# EAGLE schematic Motherboard (EAGLE 9.1.0)
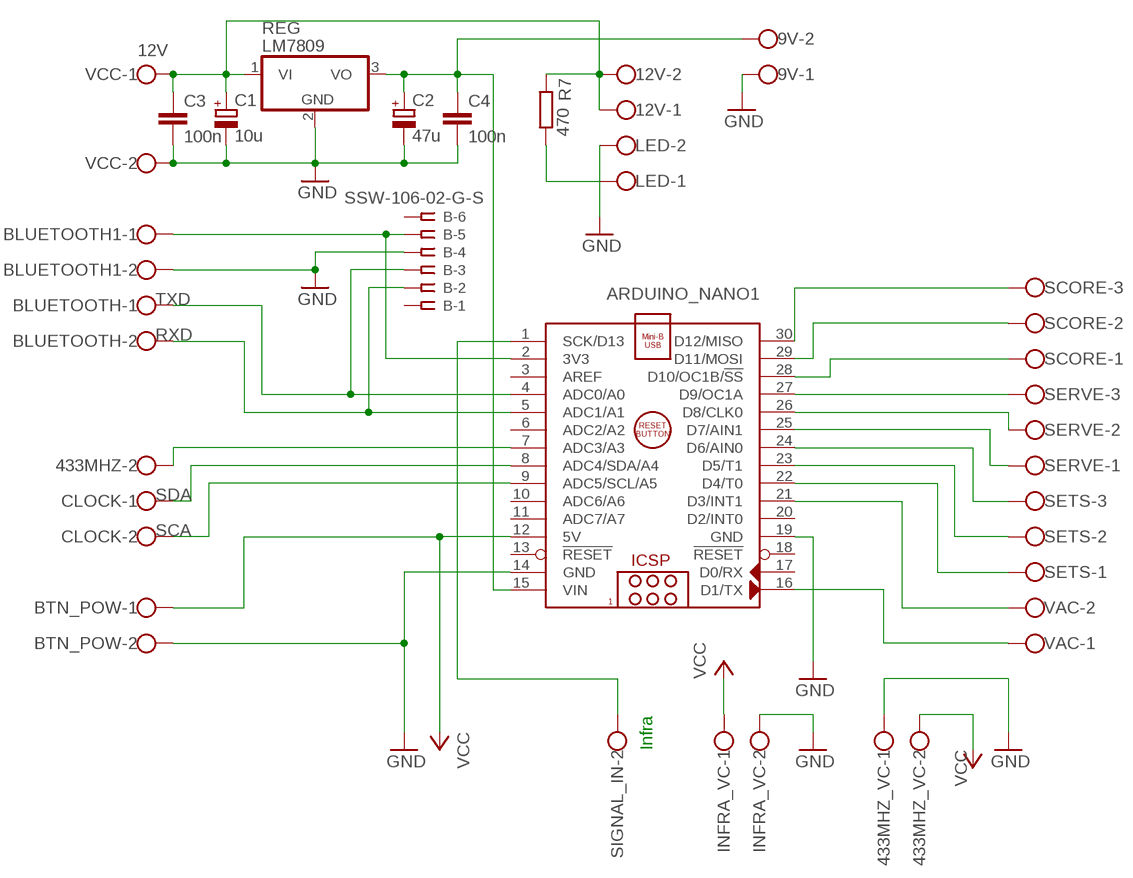
[diagram p0: schematic, sheet 1]

## Parts
9V  W237-102  [W237-102]
12V  W237-102  [W237-102]
433MHZ  W237-102  [W237-102]
433MHZ_VC  W237-102  [W237-102]
ARDUINO_NANO1  ARDUINO_NANO  [ARDUINO_NANO]
B  SSW-106-02-G-S  [SSW-106-02-G-S]
BLUETOOTH  W237-102  [W237-102]
BLUETOOTH1  W237-102  [W237-102]
BTN_POW  W237-102  [W237-102]
C1  10u  CPOL-EUE2-4  [E2-4]
C2  47u  CPOL-EUE2-4  [E2-4]
C3  100n  C5/2.5  [C5B2.5]
C4  100n  C5/2.5  [C5B2.5]
CLOCK  W237-102  [W237-102]
INFRA_VC  W237-102  [W237-102]
LED  W237-102  [W237-102]
R7  470  R-EU_0204/7  [0204/7]
REG  LM7809  7805T  [TO220H]
SCORE  W237-103  [W237-103]
SERVE  W237-103  [W237-103]
SETS  W237-103  [W237-103]
SIGNAL_IN  W237-102  [W237-102]
VAC  W237-102  [W237-102]
VCC  W237-102  [W237-102]

## Nets
3V3: ARDUINO_NANO1.2(3V3) B.5 BLUETOOTH1.1
12V: 12V.1 12V.2 C1.+ C3.1 R7.2 REG.1(VI) VCC.1
433MHZ: 433MHZ.2 ARDUINO_NANO1.7(ADC3/A3)
A4SDA: ARDUINO_NANO1.8(ADC4/SDA/A4) CLOCK.1
A5SCL: ARDUINO_NANO1.9(ADC5/SCL/A5) CLOCK.2
GND: 9V.1 433MHZ_VC.1 ARDUINO_NANO1.14(GND) ARDUINO_NANO1.19(GND) B.4 BLUETOOTH1.2 BTN_POW.2 C1.- C2.- C3.2 C4.2 INFRA_VC.2 LED.2 REG.2(GND) VCC.2
INFRA: ARDUINO_NANO1.1(SCK/D13) SIGNAL_IN.2
N$5: ARDUINO_NANO1.21(D3/INT1) VAC.2
N$6: ARDUINO_NANO1.16(D1/TX) VAC.1
N$7: LED.1 R7.1
RXD: ARDUINO_NANO1.5(ADC1/A1) B.2 BLUETOOTH.2
SCORE_1: ARDUINO_NANO1.28(D10/OC1B/!SS) SCORE.1
SCORE_2: ARDUINO_NANO1.29(D11/MOSI) SCORE.2
SCORE_3: ARDUINO_NANO1.30(D12/MISO) SCORE.3
SERVE_1: ARDUINO_NANO1.25(D7/AIN1) SERVE.1
SERVE_2: ARDUINO_NANO1.26(D8/CLK0) SERVE.2
SERVE_3: ARDUINO_NANO1.27(D9/OC1A) SERVE.3
SETS_1: ARDUINO_NANO1.22(D4/T0) SETS.1
SETS_2: ARDUINO_NANO1.23(D5/T1) SETS.2
SETS_3: ARDUINO_NANO1.24(D6/AIN0) SETS.3
TXD: ARDUINO_NANO1.4(ADC0/A0) B.3 BLUETOOTH.1
VCC: 433MHZ_VC.2 ARDUINO_NANO1.12(5V) BTN_POW.1 INFRA_VC.1
VIN_9V: 9V.2 ARDUINO_NANO1.15(VIN) C2.+ C4.1 REG.3(VO)
Unconnected: 433MHZ.1 ARDUINO_NANO1.3(AREF) ARDUINO_NANO1.6(ADC2/A2) ARDUINO_NANO1.10(ADC6/A6) ARDUINO_NANO1.11(ADC7/A7) ARDUINO_NANO1.13(!RESET) ARDUINO_NANO1.17(D0/RX) ARDUINO_NANO1.18(!RESET) ARDUINO_NANO1.20(D2/INT0) B.1 B.6 SIGNAL_IN.1

## Notes on the sheet
- TXD
- RXD
- SDA
- SCA
- Infra

## Library data of the parts
9V 12V 433MHZ 433MHZ_VC BLUETOOTH BLUETOOTH1 BTN_POW CLOCK INFRA_VC LED SIGNAL_IN VAC VCC = con-wago-500:W237-102: WAGO SCREW CLAMP; MPN: 237-102; OC_FARNELL: unknown; OC_NEWARK: 70K9898
ARDUINO_NANO1 = ArduinoNanoV30:ARDUINO_NANO: Arduino Nano V3.0 Module Overview: The Arduino Nano is a small, complete, and breadboard-friendly board based on the ATmega328 (Arduino Nano 3.x) or ATmega168 (Arduino Nano 2.x). It has more or less the same functionality of the Arduino Duemilanove, but in a different package. It lacks only a DC power jack, and works with a Mini-B USB cable instead of a standard one. The Nano was designed and is being produced by Gravitech <http://www.gravitech.us/arna30wiatp.html>. General specifications: Item Value Microcontroller Atmel ATmega168 or ATmega328 Operating Voltage (logic level) 5 V Input Voltage (recommended) 7-12 V Input Voltage (limits) 6-20 V Digital I/O Pins 14 (of which 6 provide PWM output) Analog Input Pins 8 DC Current per I/O Pin 40 mA Flash Memory 16 KB (ATmega168) or 32 KB (ATmega328) of which 2 KB used by bootloader SRAM 1 KB (ATmega168) or 2 KB (ATmega328) EEPROM 512 bytes (ATmega168) or 1 KB (ATmega328) Clock Speed 16 MHz Dimensions (Inches) 0.73" x 1.70" Dimensions (mm) 18mm x 45mm Overall height About 9 mm (not including pins) Weigth 5 g Power: The Arduino Nano can be powered via the Mini-B USB connection, 6-20V unregulated external power supply (pin 30), or 5V regulated external power supply (pin 27). The power source is automatically selected to the highest voltage source. Memory: The ATmega168 has 16 KB of flash memory for storing code (of which 2 KB is used for the bootloader); the ATmega328 has 32 KB, (also with 2 KB used for the bootloader). The ATmega168 has 1 KB of SRAM and 512 bytes of EEPROM (which can be read and written with the EEPROM library); the ATmega328 has 2 KB of SRAM and 1 KB of EEPROM. Input and Output: Each of the 14 digital pins on the Nano can be used as an input or output, using pinMode(), digitalWrite(), and digitalRead() functions. They operate at 5 volts. Each pin can provide or receive a maximum of 40 mA and has an internal pull-up resistor (disconnected by default) of 20-50 kOhms. In addition, some pins have specialized functions. Visit Arduino - ArduinoBoardNano <https://www.arduino.cc/en/Main/ArduinoBoardNano>
B = con-samtec:SSW-106-02-G-S: THROUGH-HOLE .025" SQ POST SOCKET Source: Samtec SSW.pdf; MF: Samtec Inc.; MPN: SSW-106-02-G-S; OC_FARNELL: unknown; OC_NEWARK: 11P9416
C1 C2 = rcl:CPOL-EU: POLARIZED CAPACITOR, European symbol; SPICEPREFIX: C
C3 C4 = capacitor-wima:C: CAPACITOR naming: grid - package width
R7 = resistor:R-EU_: RESISTOR, European symbol
REG = linear:78*: Positive VOLTAGE REGULATOR Source: http://cache.national.com/ds/LM/LM78L05.pdf http://www.fairchildsemi.com/ds/LM/LM7805.pdf
SCORE SERVE SETS = con-wago-500:W237-103: WAGO SCREW CLAMP; MPN: 237-103; OC_FARNELL: unknown; OC_NEWARK: 18M7116